# EAGLE design FabDisPendant (EAGLE 7.4.0)
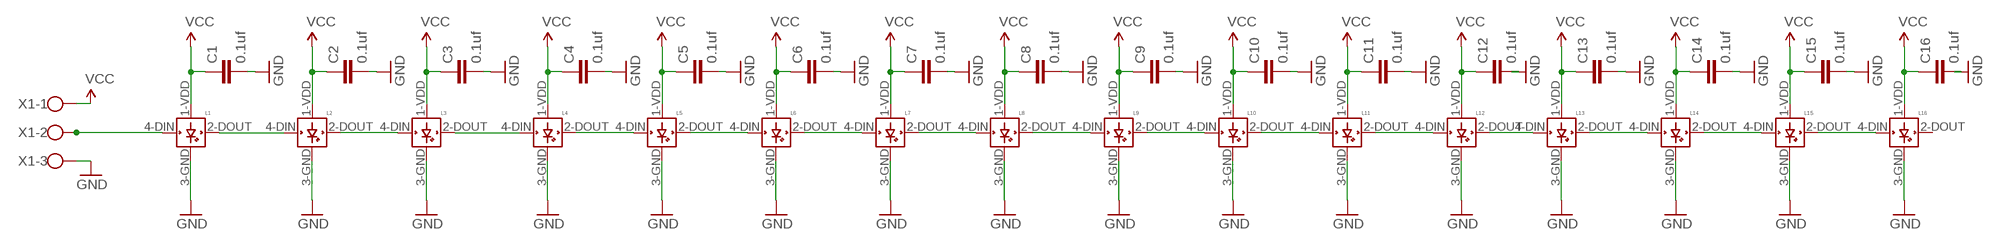
[diagram p0: schematic, sheet 1]

## Parts
C1  0.1uf  CAP0603-CAP  [0603-CAP]
C2  0.1uf  CAP0603-CAP  [0603-CAP]
C3  0.1uf  CAP0603-CAP  [0603-CAP]
C4  0.1uf  CAP0603-CAP  [0603-CAP]
C5  0.1uf  CAP0603-CAP  [0603-CAP]
C6  0.1uf  CAP0603-CAP  [0603-CAP]
C7  0.1uf  CAP0603-CAP  [0603-CAP]
C8  0.1uf  CAP0603-CAP  [0603-CAP]
C9  0.1uf  CAP0603-CAP  [0603-CAP]
C10  0.1uf  CAP0603-CAP  [0603-CAP]
C11  0.1uf  CAP0603-CAP  [0603-CAP]
C12  0.1uf  CAP0603-CAP  [0603-CAP]
C13  0.1uf  CAP0603-CAP  [0603-CAP]
C14  0.1uf  CAP0603-CAP  [0603-CAP]
C15  0.1uf  CAP0603-CAP  [0603-CAP]
C16  0.1uf  CAP0603-CAP  [0603-CAP]
L1  WS2812B  [WS2812B]
L2  WS2812B  [WS2812B]
L3  WS2812B  [WS2812B]
L4  WS2812B  [WS2812B]
L5  WS2812B  [WS2812B]
L6  WS2812B  [WS2812B]
L7  WS2812B  [WS2812B]
L8  WS2812B  [WS2812B]
L9  WS2812B  [WS2812B]
L10  WS2812B  [WS2812B]
L11  WS2812B  [WS2812B]
L12  WS2812B  [WS2812B]
L13  WS2812B  [WS2812B]
L14  WS2812B  [WS2812B]
L15  WS2812B  [WS2812B]
L16  WS2812B  [WS2812B]
X1  W237-103  [W237-103]

## Nets
GND: C1.2 C2.2 C3.2 C4.2 C5.2 C6.2 C7.2 C8.2 C9.2 C10.2 C11.2 C12.2 C13.2 C14.2 C15.2 C16.2 L1.3-GND(GND) L2.3-GND(GND) L3.3-GND(GND) L4.3-GND(GND) L5.3-GND(GND) L6.3-GND(GND) L7.3-GND(GND) L8.3-GND(GND) L9.3-GND(GND) L10.3-GND(GND) L11.3-GND(GND) L12.3-GND(GND) L13.3-GND(GND) L14.3-GND(GND) L15.3-GND(GND) L16.3-GND(GND) X1.3
N$1: L1.4-DIN(DIN) X1.2
N$2: L1.2-DOUT(DOUT) L2.4-DIN(DIN)
N$3: L2.2-DOUT(DOUT) L3.4-DIN(DIN)
N$4: L3.2-DOUT(DOUT) L4.4-DIN(DIN)
N$5: L5.2-DOUT(DOUT) L6.4-DIN(DIN)
N$6: L6.2-DOUT(DOUT) L7.4-DIN(DIN)
N$7: L7.2-DOUT(DOUT) L8.4-DIN(DIN)
N$8: L9.2-DOUT(DOUT) L10.4-DIN(DIN)
N$9: L10.2-DOUT(DOUT) L11.4-DIN(DIN)
N$10: L11.2-DOUT(DOUT) L12.4-DIN(DIN)
N$11: L8.2-DOUT(DOUT) L9.4-DIN(DIN)
N$12: L4.2-DOUT(DOUT) L5.4-DIN(DIN)
N$13: L13.2-DOUT(DOUT) L14.4-DIN(DIN)
N$14: L14.2-DOUT(DOUT) L15.4-DIN(DIN)
N$15: L15.2-DOUT(DOUT) L16.4-DIN(DIN)
N$16: L12.2-DOUT(DOUT) L13.4-DIN(DIN)
VCC: C1.1 C2.1 C3.1 C4.1 C5.1 C6.1 C7.1 C8.1 C9.1 C10.1 C11.1 C12.1 C13.1 C14.1 C15.1 C16.1 L1.1-VDD(VDD) L2.1-VDD(VDD) L3.1-VDD(VDD) L4.1-VDD(VDD) L5.1-VDD(VDD) L6.1-VDD(VDD) L7.1-VDD(VDD) L8.1-VDD(VDD) L9.1-VDD(VDD) L10.1-VDD(VDD) L11.1-VDD(VDD) L12.1-VDD(VDD) L13.1-VDD(VDD) L14.1-VDD(VDD) L15.1-VDD(VDD) L16.1-VDD(VDD) X1.1
Unconnected: L16.2-DOUT(DOUT)

## Library data of the parts
C1-C16 = SparkFun-Capacitors:CAP: Capacitor Standard 0603 ceramic capacitor, and 0.1" leaded capacitor.
L1-L16 = adafruit:WS2812B
X1 = con-wago-500:W237-103: WAGO SCREW CLAMP; MPN: 237-103; OC_FARNELL: unknown; OC_NEWARK: 18M7116

## Board
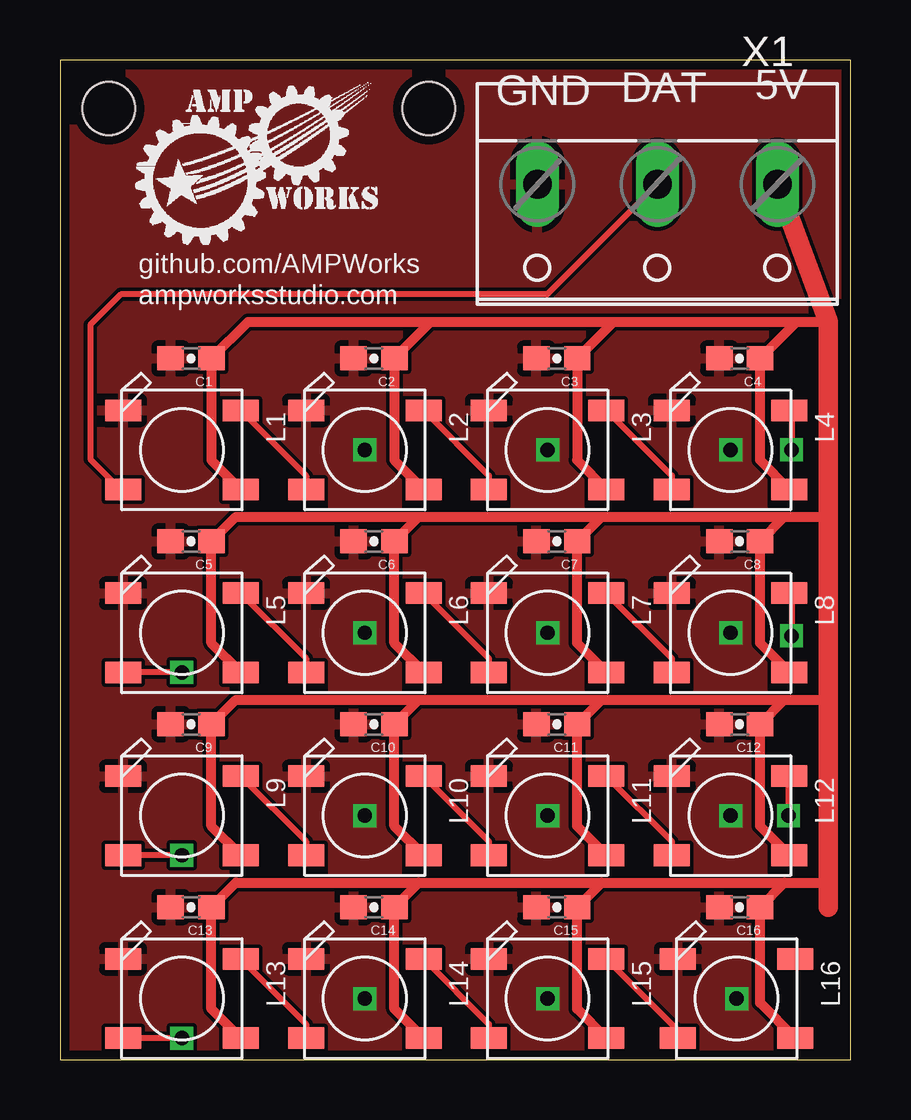
[diagram p1: board, top side]
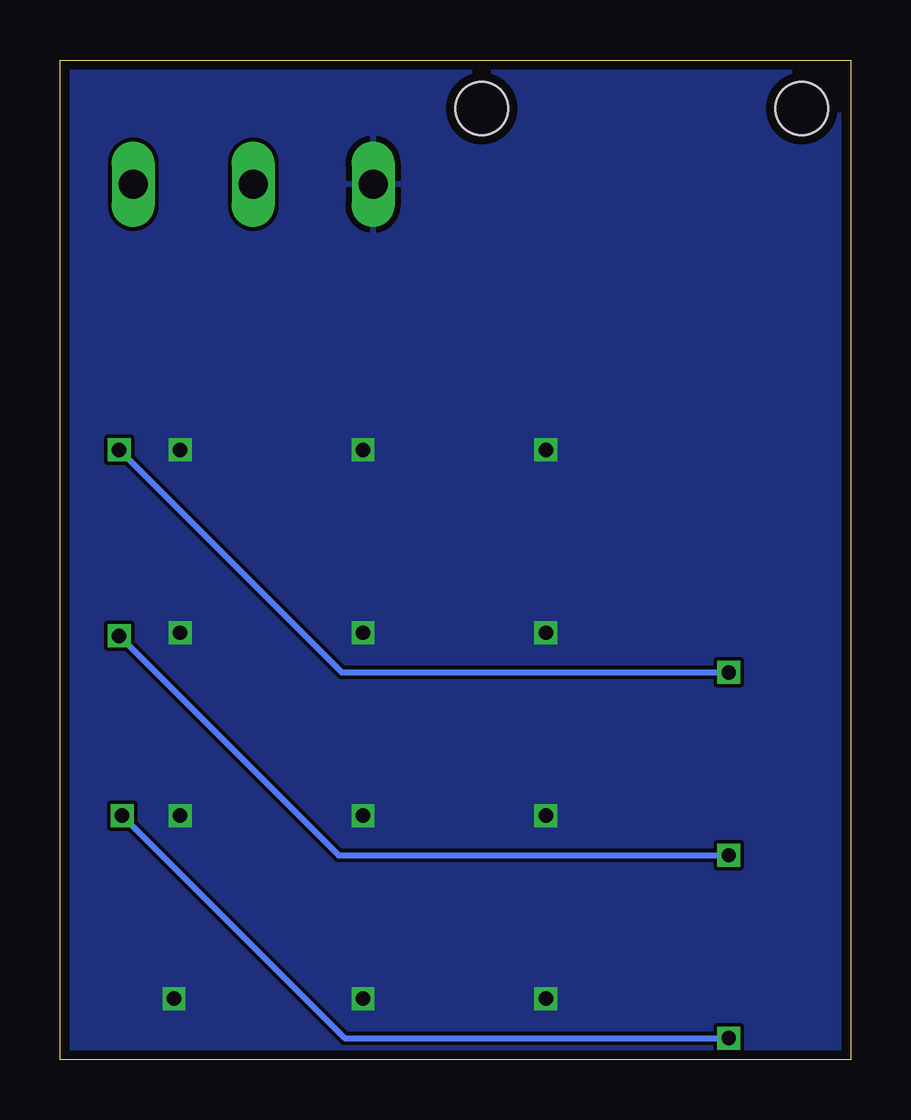
[diagram p2: board, bottom side, seen from below]

Size 32.94 x 41.65 mm. Coordinates in mm from the lower left corner, seen from the top.
Outline: 0,0 32.94,0 32.94,41.65 0,41.65 0,0
Copper layers (1*16): Top 0.0356mm / dielectric 1.5011mm / Bottom 0.0356mm
Design rules "OSHParkDesignRules": minimum track width 6mil, minimum drill 13mil, track to track 6mil, track to pad 6mil, pad to pad 6mil, via to via 6mil, smd to smd 6mil, copper to edge 15mil, drill to drill 6mil, minimum pad ring 7mil, minimum via ring 7mil, stop-mask expansion 3mil, vias tented up to drill 0mil, thermal gap 10mil
Holes 2.2 mm at 2.03,39.62 15.37,39.62

### Footprints (pad centres in the part's own frame; a part is rotated, then mirrored left to right if it is on the bottom)
0603-CAP = smd 1.1 x 1: 1 -0.85,0; 2 0.85,0
WS2812B = smd 1.5 x 0.9: 1-VDD 2.45,-1.65; 2-DOUT 2.45,1.65; 3-GND -2.45,1.65; 4-DIN -2.45,-1.65
W237-103 = drill 1.194 long: 1 -5,-1.29; 2 0,-1.29; 3 5,-1.29

### Placement (x,y rotation side)
C1  5.46,29.21 180 top
C2  13.08,29.21 180 top
C3  20.7,29.21 180 top
C4  28.32,29.21 180 top
C5  5.46,21.59 180 top
C6  13.08,21.59 180 top
C7  20.7,21.59 180 top
C8  28.32,21.59 180 top
C9  5.46,13.97 180 top
C10  13.08,13.97 180 top
C11  20.7,13.97 180 top
C12  28.32,13.97 180 top
C13  5.46,6.35 180 top
C14  13.08,6.35 180 top
C15  20.7,6.35 180 top
C16  28.32,6.35 180 top
L1  5.08,25.4 0 top
L2  12.7,25.4 0 top
L3  20.32,25.4 0 top
L4  27.94,25.4 0 top
L5  5.08,17.78 0 top
L6  12.7,17.78 0 top
L7  20.32,17.78 0 top
L8  27.94,17.78 0 top
L9  5.08,10.16 0 top
L10  12.7,10.16 0 top
L11  20.32,10.16 0 top
L12  27.94,10.16 0 top
L13  5.08,2.54 0 top
L14  12.7,2.54 0 top
L15  20.32,2.54 0 top
L16  28.19,2.54 0 top
X1  24.89,35.18 180 top

### Tracks (layer width: path | path; a pad name or v marks a point on that pad's centre or on a via)
GND  (via drill 0.6)
  other vias: 12.7,25.4 20.32,25.4 12.7,17.78 20.32,17.78 12.7,10.16 20.32,10.16 12.7,2.54 20.32,2.54 28.19,2.54 27.94,10.16 27.94,25.4 27.94,17.78
  pour Top: 0,41.66 33.15,41.66 33.15,0 0,0
  pour Bottom: 0.13,41.4 33.02,41.4 33.02,-0.13 0.13,-0.13
N$1
  Top 0.254: X1.2 20.3,31.88 2.54,31.88 1.27,30.61 1.27,25.02 2.54,23.75 L1.4-DIN
N$2
  Top 0.254: L1.2-DOUT 10.25,24.33 L2.4-DIN
N$3
  Top 0.254: L2.2-DOUT 17.87,24.33 L3.4-DIN
N$4
  Top 0.254: L3.2-DOUT 25.49,24.33 L4.4-DIN
N$5
  Top 0.254: L5.2-DOUT 10.25,16.71 L6.4-DIN
N$6
  Top 0.254: L6.2-DOUT 17.87,16.71 L7.4-DIN
N$7
  Top 0.254: L7.2-DOUT 25.49,16.71 L8.4-DIN
N$8
  Top 0.254: L9.2-DOUT 10.25,9.09 L10.4-DIN
N$9
  Top 0.254: L10.2-DOUT 17.87,9.09 L11.4-DIN
N$10
  Top 0.254: L11.2-DOUT 25.49,9.09 L12.4-DIN
N$11  (via drill 0.6)
  Top 0.254: L8.2-DOUT 30.48,19.34 v30.48,17.65 | v5.08,8.51 L9.4-DIN
  Bottom 0.254: v30.48,17.65 21.34,8.51 v5.08,8.51
N$12  (via drill 0.6)
  Top 0.254: L4.2-DOUT 30.48,26.96 v30.48,25.4 | v5.08,16.13 L5.4-DIN
  Bottom 0.254: v30.48,25.4 21.21,16.13 v5.08,16.13
N$13
  Top 0.254: L13.2-DOUT 10.25,1.47 L14.4-DIN
N$14
  Top 0.254: L14.2-DOUT 17.87,1.47 L15.4-DIN
N$15
  Top 0.254: L15.2-DOUT 25.74,1.22 L16.4-DIN
N$16  (via drill 0.6)
  Top 0.254: L12.2-DOUT 30.35,11.77 v30.35,10.16 | v5.08,0.89 L13.4-DIN
  Bottom 0.254: v30.35,10.16 21.08,0.89 v5.08,0.89
VCC
  Top 0.406: 23.07,30.73 C3.1 21.55,24.97 L3.1-VDD | 23.07,30.73 30.7,30.73 | 30.7,30.73 C4.1 29.17,24.97 L4.1-VDD | 30.7,30.73 32,30.73 | 15.46,30.73 C2.1 13.93,24.97 L2.1-VDD | 15.46,30.73 23.07,30.73 | 15.46,30.73 7.83,30.73 C1.1 6.31,24.97 L1.1-VDD | L5.1-VDD 6.31,17.35 C5.1 7.33,22.61 14.95,22.61 | L6.1-VDD 13.93,17.35 C6.1 14.95,22.61 | L7.1-VDD 21.55,17.35 C7.1 22.57,22.61 | L8.1-VDD 29.17,17.35 C8.1 30.19,22.61 | L9.1-VDD 6.31,9.73 C9.1 7.33,14.99 14.95,14.99 | L10.1-VDD 13.93,9.73 C10.1 14.95,14.99 | L11.1-VDD 21.55,9.73 C11.1 22.57,14.99 | L12.1-VDD 29.17,9.73 C12.1 30.19,14.99 | L13.1-VDD 6.31,2.11 C13.1 7.33,7.37 14.95,7.37 | L14.1-VDD 13.93,2.11 C14.1 14.95,7.37 | L15.1-VDD 21.55,2.11 C15.1 22.57,7.37 | L16.1-VDD 29.17,2.36 C16.1 30.19,7.37 | 30.19,22.61 32,22.61 | 22.57,22.61 30.19,22.61 | 14.95,22.61 22.57,22.61 | 30.19,14.99 32,14.99 | 22.57,14.99 30.19,14.99 | 14.95,14.99 22.57,14.99 | 30.19,7.37 32,7.37 | 22.57,7.37 30.19,7.37 | 14.95,7.37 22.57,7.37
  Top 0.813: X1.1 32,30.73 32,22.61 32,14.99 32,7.37 32,6.35

### Text on the board
tPlace: GND | DAT | 5V | github.com/AMPWorks | ampworksstudio.com